# EAGLE design main (EAGLE 9.6.2)

## Sheet 1 of 4
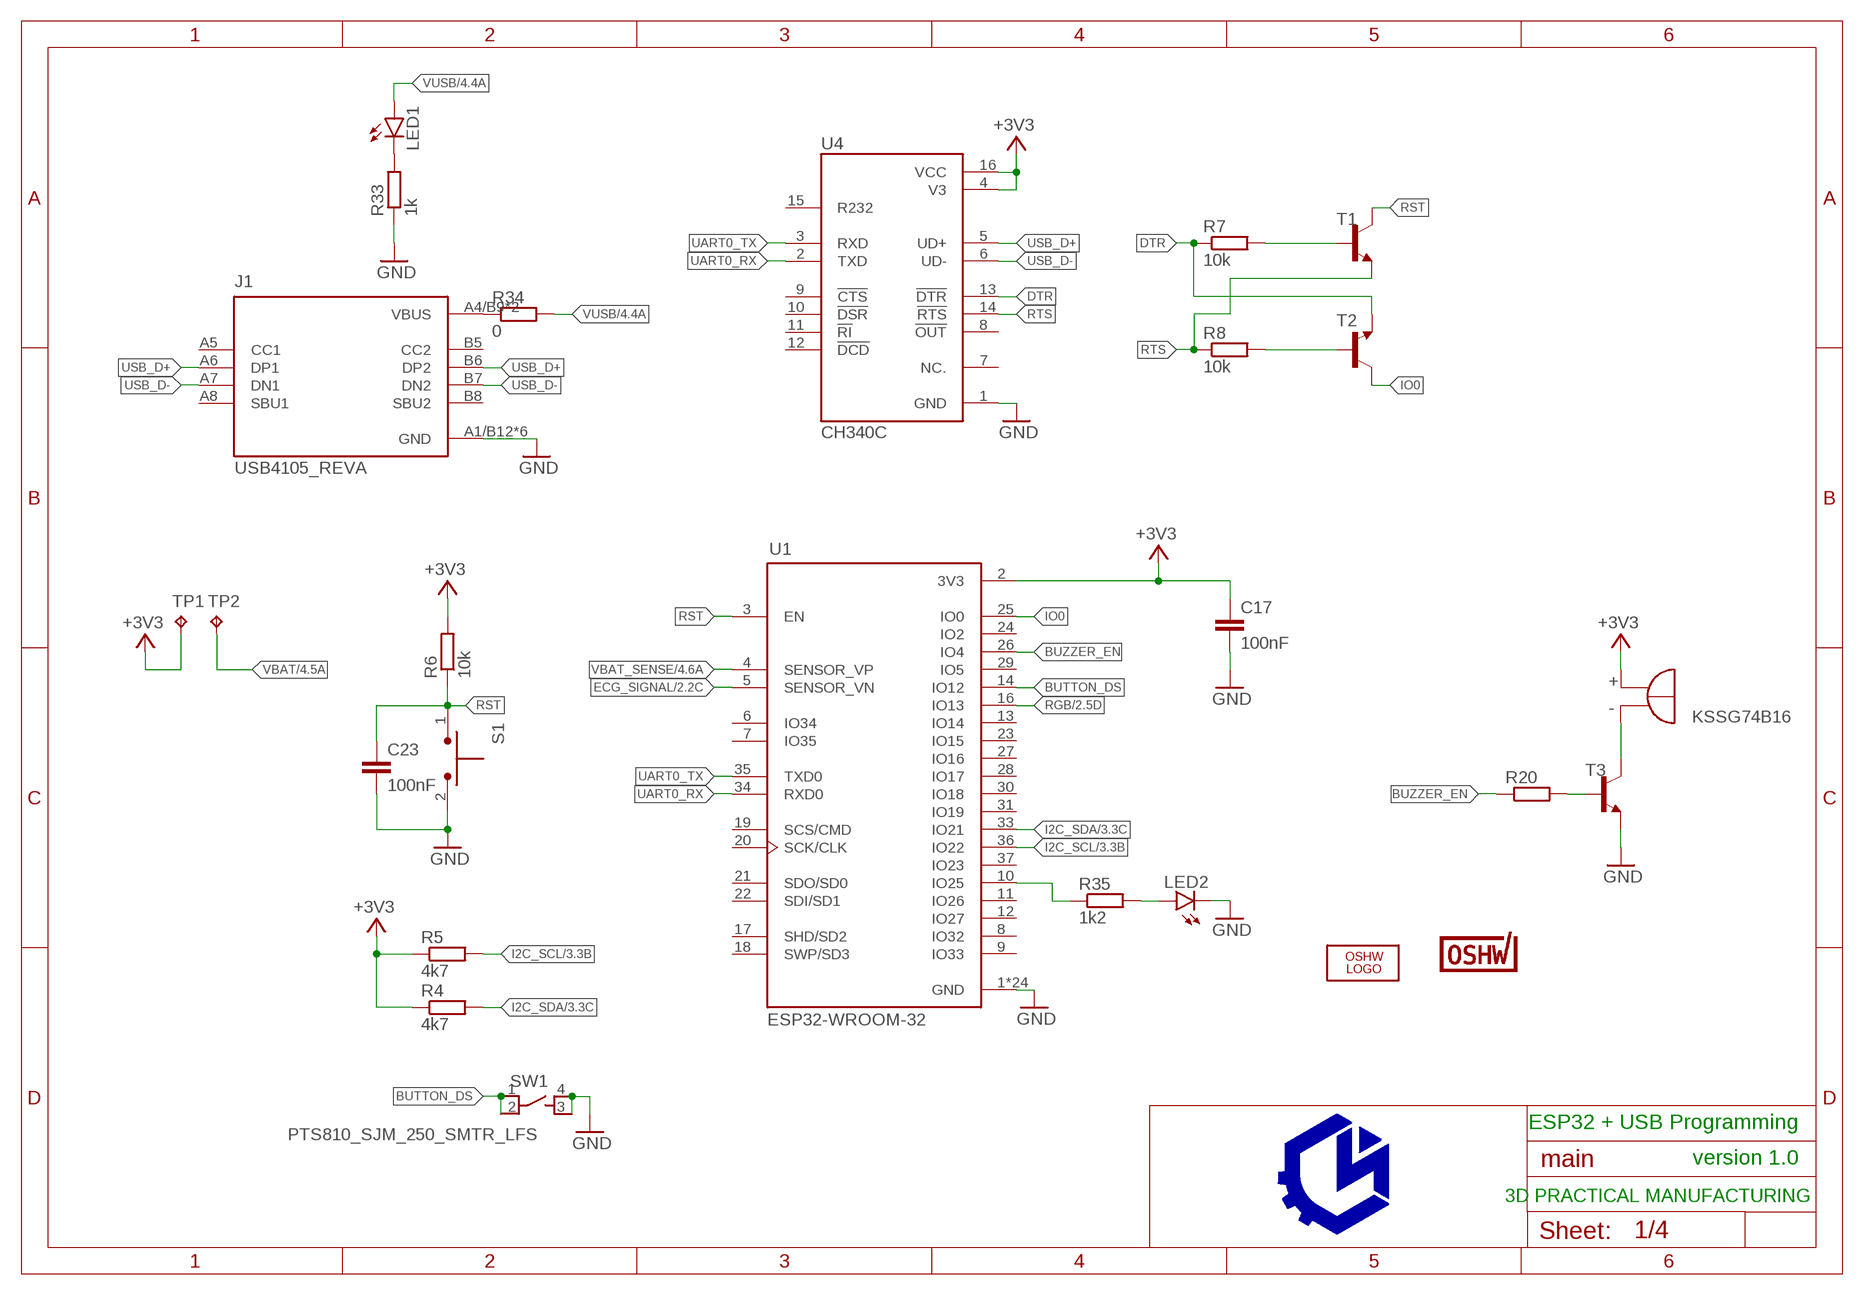
[diagram p0: schematic, sheet 1]

### Parts
C17  100nF  C-EUC0603  [C0603]
C23  100nF  C-EUC0603  [C0603]
J1  USB4105_REVA  [GCT_USB4105_REVA]
LED1  LEDCHIP-LED0805  [CHIP-LED0805]
LED2  LEDCHIP-LED0805  [CHIP-LED0805]
LOGO2  OSHW_LOGO_FILLX0200-NT  [OSHW_FILLX200_NOTEXT]
LS1  KSSG74B16  [XDCR_KSSG74B16]
R4  4k7  R-EU_R0603  [R0603]
R5  4k7  R-EU_R0603  [R0603]
R6  10k  R-EU_R0603  [R0603]
R7  10k  R-EU_R0603  [R0603]
R8  10k  R-EU_R0603  [R0603]
R20  R-EU_R0603  [R0603]
R33  1k  R-EU_R0603  [R0603]
R34  0  R-EU_R0603  [R0603]
R35  1k2  R-EU_R0603  [R0603]
S1  TL1015AF160QG  [SW_TL1015AF160QG]
SW1  PTS810_SJM_250_SMTR_LFS  [SW_PTS810_SJM_250_SMTR_LFS]
T1  MMBT4401LT1-NPN-SOT23-BEC  [SOT23-BEC]
T2  MMBT4401LT1-NPN-SOT23-BEC  [SOT23-BEC]
T3  MMBT4401LT1-NPN-SOT23-BEC  [SOT23-BEC]
TP1  TPB1,27  [B1,27]
TP2  TPB1,27  [B1,27]
U1  ESP32-WROOM-32  [MODULE_ESP32-WROOM-32]
U4  CH340C  [SOIC127P600X180-16N]
U$10  CERT-SMALL  [CERT-SMALL-SILK]

### Nets
+3V3: C17.1 LS1.P(POS) R4.1 R5.1 R6.2 TP1.TP U1.2(3V3) U4.4(V3) U4.16(VCC) ; also sheet 2,3,4
BUTTON_DS: SW1.1 SW1.2 U1.14(IO12)
BUZZER_EN: R20.1 U1.26(IO4)
DTR: R7.1 T2.E U4.13(!DTR)
ECG_SIGNAL: U1.5(SENSOR_VN) ; also sheet 2
GND: C17.2 C23.2 J1.A1/B12(GND) J1.B1/A12(GND) J1.G1(GND) J1.G2(GND) J1.G3(GND) J1.G4(GND) LED2.C R33.1 S1.2 SW1.3 SW1.4 T3.E U1.1(GND) U1.15(GND) U1.38(GND) U1.39_1(GND) U1.39_2(GND) U1.39_3(GND) U1.39_4(GND) U1.39_5(GND) U1.39_6(GND) U1.39_7(GND) U1.39_8(GND) U1.39_9(GND) U1.39_10(GND) U1.39_11(GND) U1.39_12(GND) U1.39_13(GND) U1.39_14(GND) U1.39_15(GND) U1.39_16(GND) U1.39_17(GND) U1.39_18(GND) U1.39_19(GND) U1.39_20(GND) U1.39_21(GND) U4.1(GND) ; also sheet 2,3,4
I2C_SCL: R5.2 U1.36(IO22) ; also sheet 3
I2C_SDA: R4.2 U1.33(IO21) ; also sheet 3
IO0: T2.C U1.25(IO0)
N$1: R7.2 T1.B
N$2: R8.2 T2.B
N$5: R20.2 T3.B
N$15: LED1.C R33.2
N$20: J1.A4/B9(VBUS) J1.B4/A9(VBUS) R34.1
N$22: LS1.N(NEG) T3.C
N$32: R35.1 U1.10(IO25)
N$33: LED2.A R35.2
RGB: U1.16(IO13) ; also sheet 2
RST: C23.1 R6.1 S1.1 T1.C U1.3(EN)
RTS: R8.1 T1.E U4.14(!RTS)
UART0_RX: U1.34(RXD0) U4.2(TXD)
UART0_TX: U1.35(TXD0) U4.3(RXD)
USB_D+: J1.A6(DP1) J1.B6(DP2) U4.5(UD+)
USB_D-: J1.A7(DN1) J1.B7(DN2) U4.6(UD-)
VBAT: TP2.TP ; also sheet 4
VBAT_SENSE: U1.4(SENSOR_VP) ; also sheet 4
VUSB: LED1.A R34.2 ; also sheet 4
Unconnected: J1.A5(CC1) J1.A8(SBU1) J1.B5(CC2) J1.B8(SBU2) U1.6(IO34) U1.7(IO35) U1.8(IO32) U1.9(IO33) U1.11(IO26) U1.12(IO27) U1.13(IO14) U1.17(SHD/SD2) U1.18(SWP/SD3) U1.19(SCS/CMD) U1.20(SCK/CLK) U1.21(SDO/SD0) U1.22(SDI/SD1) U1.23(IO15) U1.24(IO2) U1.27(IO16) U1.28(IO17) U1.29(IO5) U1.30(IO18) U1.31(IO19) U1.37(IO23) U4.7(NC.) U4.8(!OUT) U4.9(!CTS) U4.10(!DSR) U4.11(!RI) U4.12(!DCD) U4.15(R232)

### Notes on the sheet
- ESP32 + USB Programming
- version 1.0
- 3D PRACTICAL MANUFACTURING

## Sheet 2 of 4
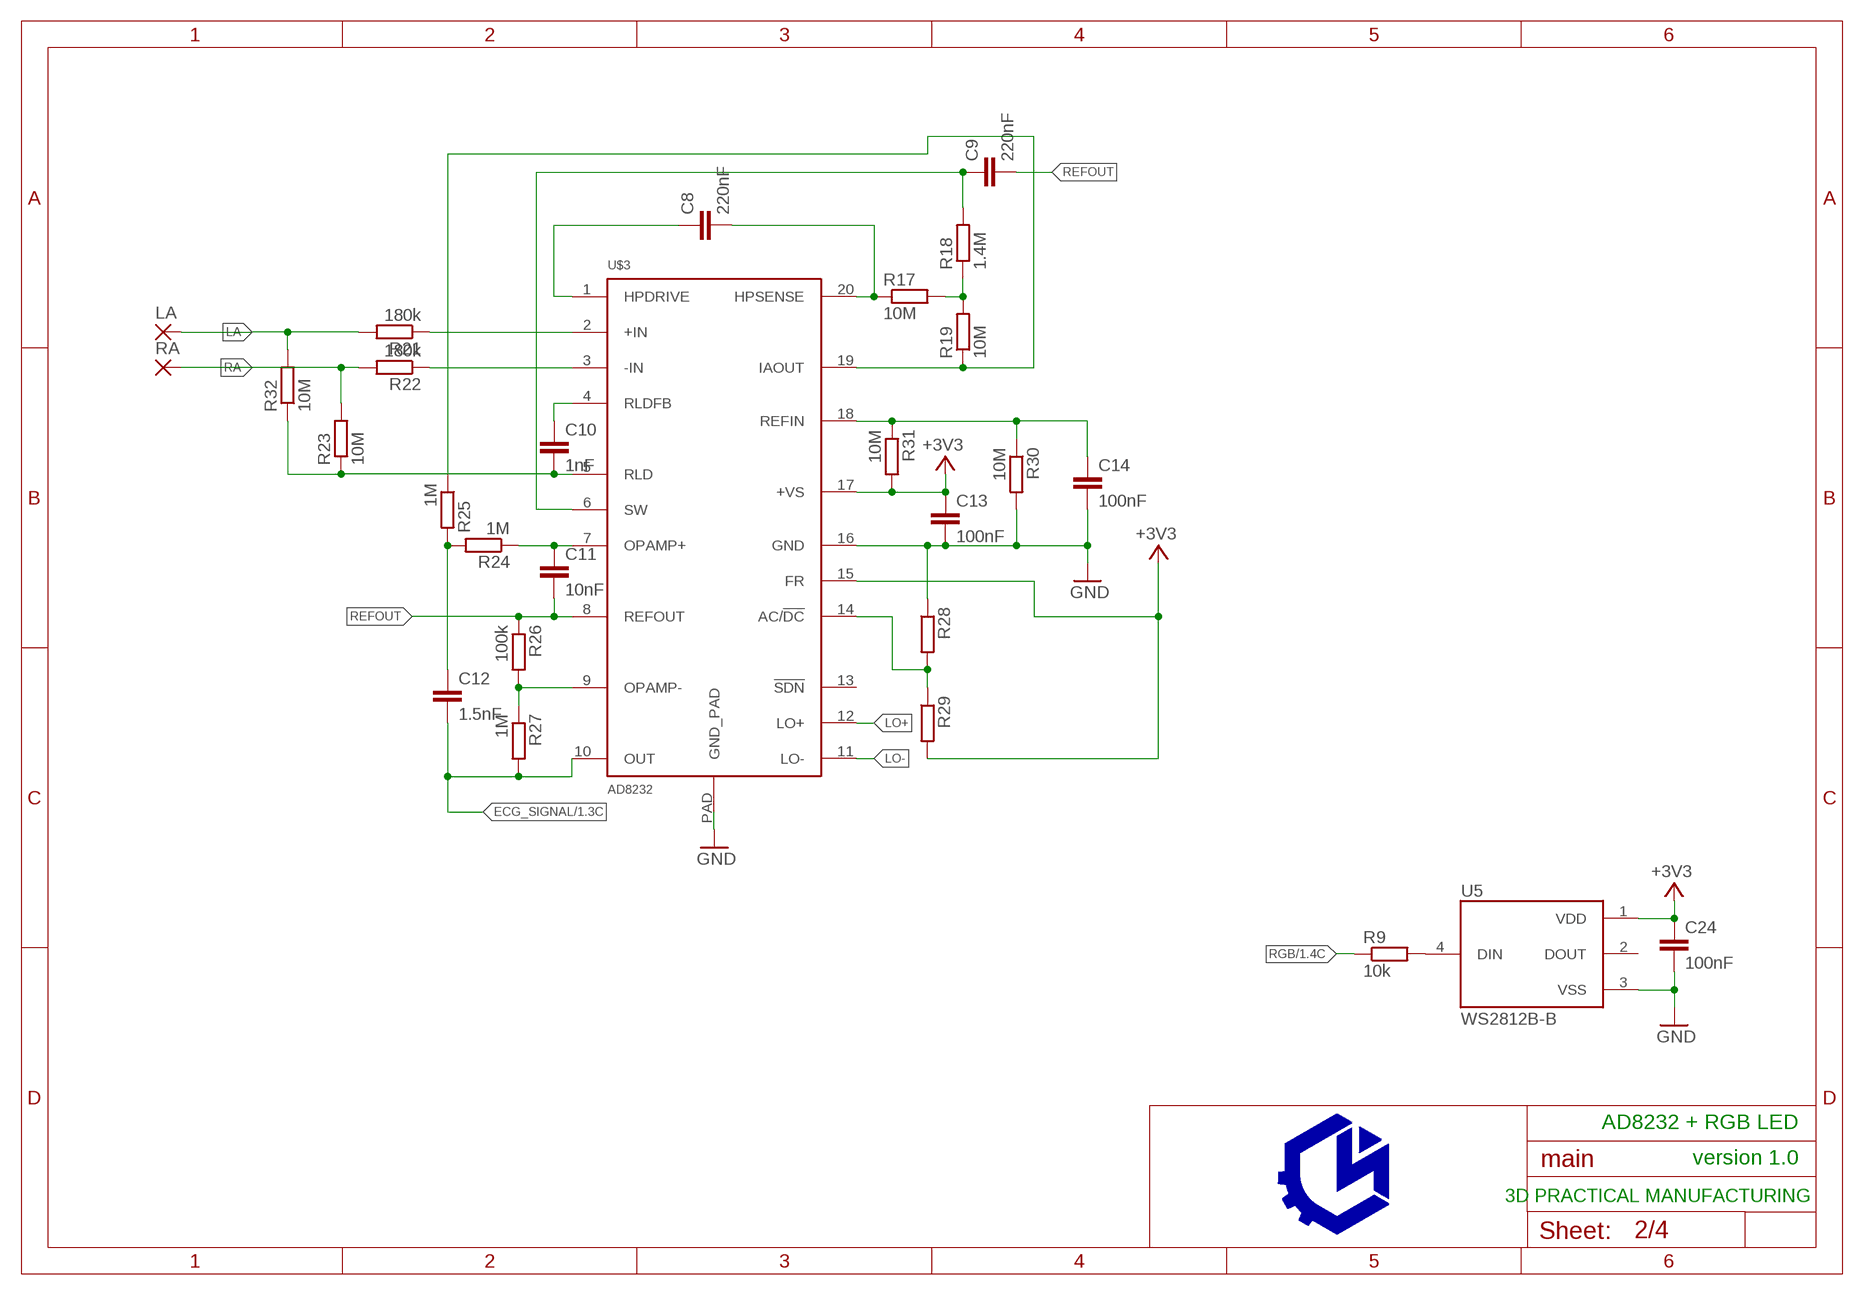
[diagram p1: schematic, sheet 2]

### Parts
C8  220nF  C-EUC0603  [C0603]
C9  220nF  C-EUC0603  [C0603]
C10  1nF  C-EUC0603  [C0603]
C11  10nF  C-EUC0603  [C0603]
C12  1.5nF  C-EUC0603  [C0603]
C13  100nF  C-EUC0603  [C0603]
C14  100nF  C-EUC0603  [C0603]
C24  100nF  C-EUC0603  [C0603]
LA  SMD2  [SMD1,27-2,54]
R9  10k  R-EU_R0603  [R0603]
R17  10M  R-EU_R0603  [R0603]
R18  1.4M  R-EU_R0603  [R0603]
R19  10M  R-EU_R0603  [R0603]
R21  180k  R-EU_R0603  [R0603]
R22  180k  R-EU_R0603  [R0603]
R23  10M  R-EU_R0603  [R0603]
R24  1M  R-EU_R0603  [R0603]
R25  1M  R-EU_R0603  [R0603]
R26  100k  R-EU_R0603  [R0603]
R27  1M  R-EU_R0603  [R0603]
R28  R-EU_R0603  [R0603]
R29  R-EU_R0603  [R0603]
R30  10M  R-EU_R0603  [R0603]
R31  10M  R-EU_R0603  [R0603]
R32  10M  R-EU_R0603  [R0603]
RA  SMD2  [SMD1,27-2,54]
U5  WS2812B-B  [LED_WS2812B-B]
U$3  AD8232  [LFCSP_20]

### Nets
+3V3: C13.1 C24.1 R29.2 R31.2 U5.1(VDD) U$3.15(FR) U$3.17(+VS) ; also sheet 1,3,4
ECG_SIGNAL: C12.2 R27.2 U$3.10(OUT) ; also sheet 1
GND: C13.2 C14.2 C24.2 R28.1 R30.2 U5.3(VSS) U$3.16(GND) U$3.PAD(GND_PAD) ; also sheet 1,3,4
LA: LA.1(P) R21.2 R32.2
LO+: U$3.12(LO+)
LO-: U$3.11(LO-)
N$3: R9.2 U5.4(DIN)
N$10: C8.2 R17.1 U$3.20(HPSENSE)
N$11: C8.1 U$3.1(HPDRIVE)
N$12: R19.1 R25.1 U$3.19(IAOUT)
N$13: R17.2 R18.1 R19.2
N$14: C9.1 R18.2 U$3.6(SW)
N$16: C12.1 R24.2 R25.2
N$18: R21.1 U$3.2(+IN)
N$19: R22.1 U$3.3(-IN)
N$30: C10.1 U$3.4(RLDFB)
N$31: C10.2 R23.1 R32.1 U$3.5(RLD)
N$34: C11.1 R24.1 U$3.7(OPAMP+)
N$36: R26.2 R27.1 U$3.9(OPAMP-)
N$38: R28.2 R29.1 U$3.14(AC/!DC)
N$39: C14.1 R30.1 R31.1 U$3.18(REFIN)
RA: R22.2 R23.2 RA.1(P)
REFOUT: C9.2 C11.2 R26.1 U$3.8(REFOUT)
RGB: R9.1 ; also sheet 1
Unconnected: U5.2(DOUT) U$3.13(!SDN)

### Notes on the sheet
- AD8232 + RGB LED
- version 1.0
- 3D PRACTICAL MANUFACTURING

## Sheet 3 of 4
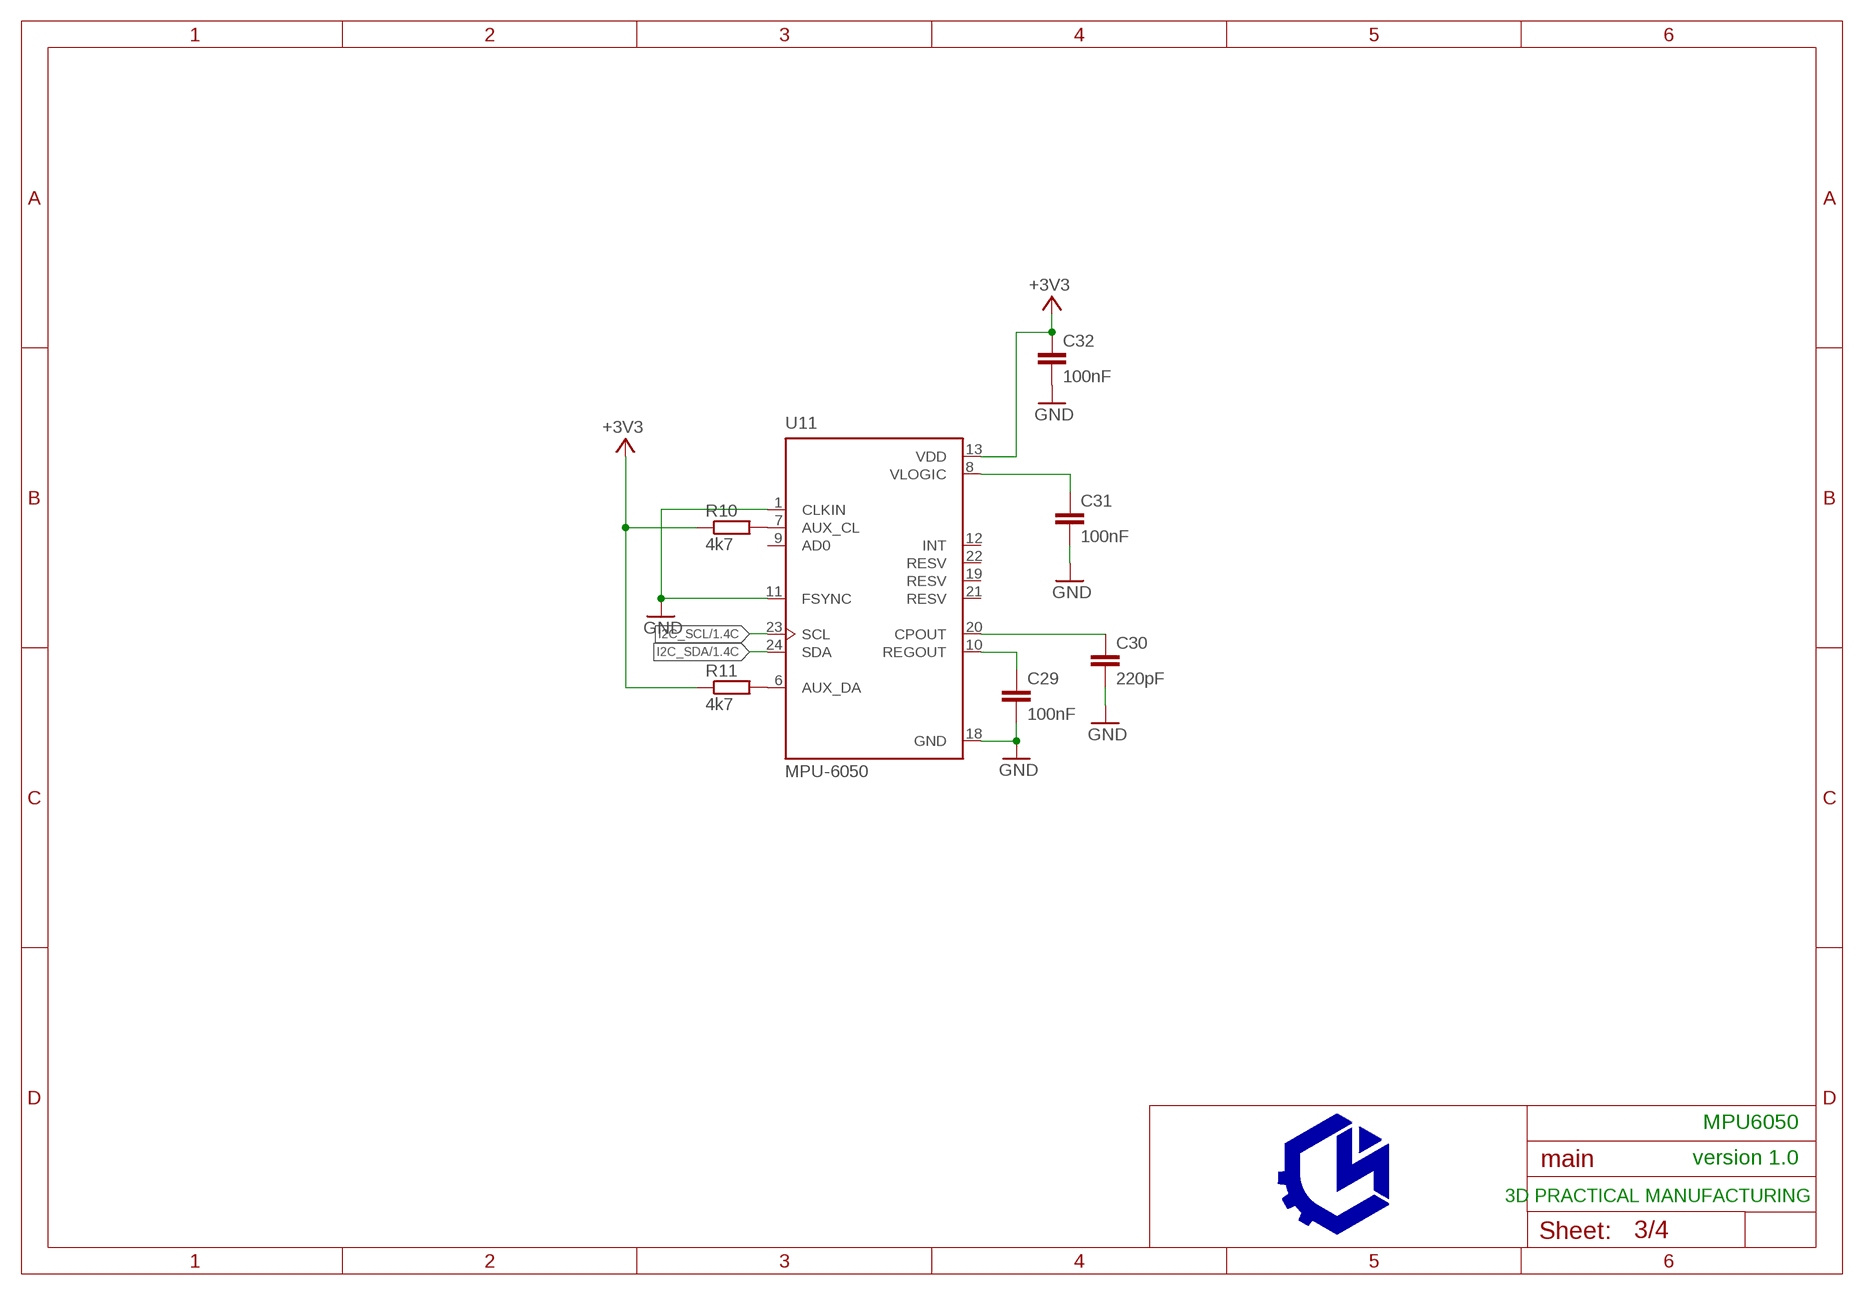
[diagram p2: schematic, sheet 3]

### Parts
C29  100nF  C-EUC0603  [C0603]
C30  220pF  C-EUC0603  [C0603]
C31  100nF  C-EUC0603  [C0603]
C32  100nF  C-EUC0603  [C0603]
R10  4k7  R-EU_R0603  [R0603]
R11  4k7  R-EU_R0603  [R0603]
U11  MPU-6050  [QFN50P400X400X95-24N]

### Nets
+3V3: C32.1 R10.1 R11.1 U11.13(VDD) ; also sheet 1,2,4
GND: C29.2 C30.2 C31.2 C32.2 U11.1(CLKIN) U11.11(FSYNC) U11.18(GND) ; also sheet 1,2,4
I2C_SCL: U11.23(SCL) ; also sheet 1
I2C_SDA: U11.24(SDA) ; also sheet 1
N$8: C29.1 U11.10(REGOUT)
N$24: R10.2 U11.7(AUX_CL)
N$25: R11.2 U11.6(AUX_DA)
N$26: C31.1 U11.8(VLOGIC)
N$27: C30.1 U11.20(CPOUT)
Unconnected: U11.9(AD0) U11.12(INT) U11.19(RESV) U11.21(RESV) U11.22(RESV)

### Notes on the sheet
- MPU6050
- version 1.0
- 3D PRACTICAL MANUFACTURING

## Sheet 4 of 4
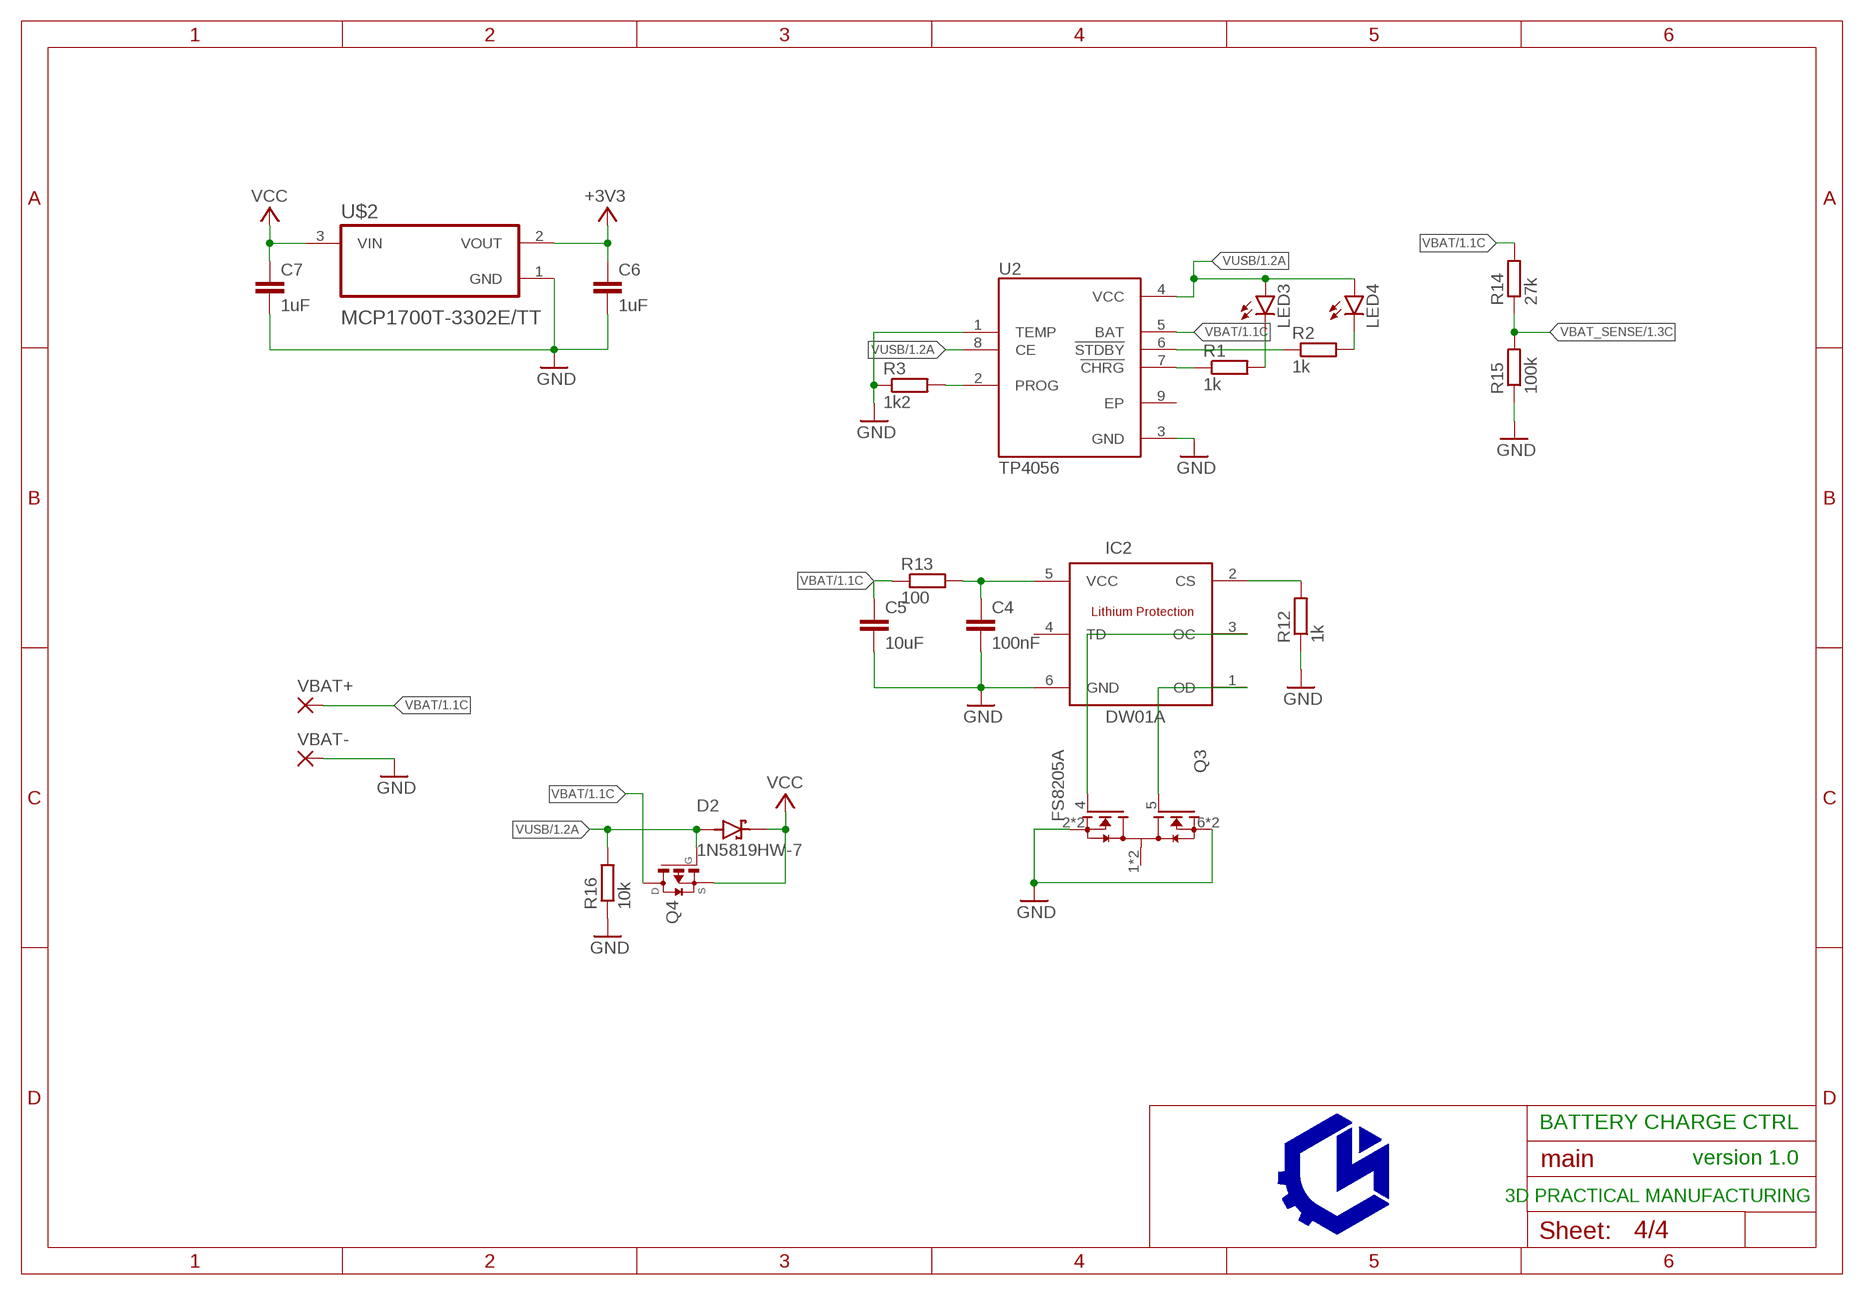
[diagram p3: schematic, sheet 4]

### Parts
C4  100nF  C-EUC0603  [C0603]
C5  10uF  C-EUC0603  [C0603]
C6  1uF  C-EUC0603  [C0603]
C7  1uF  C-EUC0603  [C0603]
D2  1N5819HW-7  [SOD3715X145N]
IC2  DW01A  [SOT23-6]
LED3  LEDCHIP-LED0603  [CHIP-LED0603]
LED4  LEDCHIP-LED0603  [CHIP-LED0603]
Q3  FS8205A  [SOP65P640X120-8N]
Q4  TRANSISTOR-FET_DMP2004K  [TRANSISTOR-FET_SOT23]
R1  1k  R-EU_R0603  [R0603]
R2  1k  R-EU_R0603  [R0603]
R3  1k2  R-EU_R0603  [R0603]
R12  1k  R-EU_R0603  [R0603]
R13  100  R-EU_R0603  [R0603]
R14  27k  R-EU_R0603  [R0603]
R15  100k  R-EU_R0603  [R0603]
R16  10k  R-EU_R0603  [R0603]
U2  TP4056  [SOP127P600X175-9N]
U$2  MCP1700T-3302E/TT  [SOT95P237X112-3N]
VBAT+  WIREPADSMD1,27-254  [SMD1,27-2,54]
VBAT-  WIREPADSMD1,27-254  [SMD1,27-2,54]

### Nets
+3V3: C6.1 U$2.2(VOUT) ; also sheet 1,2,3
GND: C4.2 C5.2 C6.2 C7.2 IC2.6(GND) Q3.2(S1) Q3.3(S1) Q3.6(S2) Q3.7(S2) R3.1 R12.1 R15.1 R16.1 U2.1(TEMP) U2.3(GND) U$2.1(GND) VBAT-.1(P) ; also sheet 1,2,3
N$4: R2.1 U2.6(!STDBY)
N$6: LED3.C R1.2
N$7: LED4.C R2.2
N$9: R1.1 U2.7(!CHRG)
N$17: R3.2 U2.2(PROG)
N$21: IC2.1(OD) Q3.5(G2)
N$23: IC2.3(OC) Q3.4(G1)
N$28: IC2.2(CS) R12.2
N$29: C4.1 IC2.5(VCC) R13.2
VBAT: C5.1 Q4.3(D) R13.1 R14.2 U2.5(BAT) VBAT+.1(P) ; also sheet 1
VBAT_SENSE: R14.1 R15.2 ; also sheet 1
VCC: C7.1 D2.C(K) Q4.2(S) U$2.3(VIN)
VUSB: D2.A LED3.A LED4.A Q4.1(G) R16.2 U2.4(VCC) U2.8(CE) ; also sheet 1
Unconnected: IC2.4(TD) Q3.1(D12) Q3.8(D12) U2.9(EP)

### Notes on the sheet
- BATTERY CHARGE CTRL
- version 1.0
- 3D PRACTICAL MANUFACTURING

## Library data of the parts
C4-C14 C17 C23 C24 C29-C32 = rcl:C-EU: CAPACITOR, European symbol; SPICEPREFIX: C
D2 = 1N5819HW-7:1N5819HW-7: 1N5819HW Series 40 V 1 A Surface Mount Schottky Barrier Rectifier - SOD-123 Check availability <https://pricing.snapeda.com/parts/1N5819HW-7/Diodes%20Inc./view-part?ref=eda>; AVAILABILITY: In Stock; DESCRIPTION: Diode Schottky 40 V 1A Surface Mount SOD-123; MF: Diodes Inc.; MP: 1N5819HW-7; PACKAGE: SOD-123 Fairchild Semiconductor; PRICE: None; PURCHASE-URL: https://pricing.snapeda.com/search/part/1N5819HW-7/?ref=eda
IC2 = DW01A:DW01A: Check availability <https://pricing.snapeda.com/parts/DW01A/Fortune%20Semiconductor/view-part?ref=eda>; AVAILABILITY: Not in stock; DESCRIPTION: One Cell Lithium-ion/Polymer Battery Protection IC; MF: Fortune Semiconductor; MP: DW01A; PACKAGE: SOT-23-6 Fortune Semiconductor; PRICE: None
J1 = USB4105_REVA:USB4105_REVA: USB Type C Receptacle for USB 2.0 SMT Type, PCB Top Mount; AVAILABILITY: Unavailable; DESCRIPTION: USB-C (USB TYPE-C) USB 2.0 Receptacle Connector 24 (16+8 Dummy) Position Surface Mount, Right Angle; Through Hole; MF: Global Connector Technology; MP: USB4105; PACKAGE: Package; PRICE: None
LA RA = wirepad:SMD2: SMD PAD
LED1-LED4 = led:LED: LED OSRAM: - CHIPLED LG R971, LG N971, LY N971, LG Q971, LY Q971, LO R971, LY R971 LH N974, LH R974 LS Q976, LO Q976, LY Q976 LO Q996 - Hyper CHIPLED LW Q18S LB Q993, LB Q99A, LB R99A - SideLED LS A670, LO A670, LY A670, LG A670, LP A670 LB A673, LV A673, LT A673, LW A673 LH A674 LY A675 LS A676, LA A676, LO A676, LY A676, LW A676 LS A679, LY A679, LG A679 - Hyper Micro SIDELED® LS Y876, LA Y876, LO Y876, LY Y876 LT Y87S - SmartLED LW L88C, LW L88S LB L89C, LB L89S, LG L890 LS L89K, LO L89K, LY L89K LS L896, LA L896, LO L896, LY L896 - TOPLED LS T670, LO T670, LY T670, LG T670, LP T670 LSG T670, LSP T670, LSY T670, LOP T670, LYG T670 LG T671, LOG T671, LSG T671 LB T673, LV T673, LT T673, LW T673 LH T674 LS T676, LA T676, LO T676, LY T676, LB T676, LH T676, LSB T676, LW T676 LB T67C, LV T67C, LT T67C, LS T67K, LO T67K, LY T67K, LW E67C LS E67B, LA E67B, LO E67B, LY E67B, LB E67C, LV E67C, LT E67C LW T67C LS T679, LY T679, LG T679 LS T770, LO T770, LY T770, LG T770, LP T770 LB T773, LV T773, LT T773, LW T773 LH T774 LS E675, LA E675, LY E675, LS T675 LS T776, LA T776, LO T776, LY T776, LB T776 LHGB T686 LT T68C, LB T68C - Hyper Mini TOPLED® LB M676 - Mini TOPLED Santana® LG M470 LS M47K, LO M47K, LY M47K Source: http://www.osram.convergy.de LUXEON: - LUMILED® LXK2-PW12-R00, LXK2-PW12-S00, LXK2-PW14-U00, LXK2-PW14-V00 LXK2-PM12-R00, LXK2-PM12-S00, LXK2-PM14-U00 LXK2-PE12-Q00, LXK2-PE12-R00, LXK2-PE12-S00, LXK2-PE14-T00, LXK2-PE14-U00 LXK2-PB12-K00, LXK2-PB12-L00, LXK2-PB12-M00, LXK2-PB14-N00, LXK2-PB14-P00, LXK2-PB14-Q00 LXK2-PR12-L00, LXK2-PR12-M00, LXK2-PR14-Q00, LXK2-PR14-R00 LXK2-PD12-Q00, LXK2-PD12-R00, LXK2-PD12-S00 LXK2-PH12-R00, LXK2-PH12-S00 LXK2-PL12-P00, LXK2-PL12-Q00, LXK2-PL12-R00 Source: www.luxeon.com KINGBRIGHT: KA-3528ASYC Source: www.kingbright.com
LOGO2 = ohw-logo:OSHW_LOGO_FILL
LS1 = KSSG74B16:KSSG74B16: Check availability <https://pricing.snapeda.com/parts/KSSG74B16/Kingstate/view-part?ref=eda>; AVAILABILITY: In Stock; DESCRIPTION: 8.5mm, 3.6V, 2.73KHz, 87dB, High SPL Magnetic Buzzer, SMT; MF: Kingstate; MP: KSSG74B16; PACKAGE: DIP-16 kingstate; PRICE: None
Q3 = FS8205A:FS8205A: N/A Check availability <https://pricing.snapeda.com/parts/FS8205A/Fortune%20Semiconductor/view-part?ref=eda>; AVAILABILITY: Not in stock; MF: Fortune Semiconductor; MP: FS8205A; PACKAGE: Package; PRICE: None
Q4 = 52101-101-REV-A_v16:TRANSISTOR-FET_DMP2004K: P-Channel Enhancement MOSFET
R1-R35 = rcl:R-EU_: RESISTOR, European symbol; SPICEPREFIX: R
S1 = TL1015AF160QG:TL1015AF160QG: Tactile Switch SPST-NO Top Actuated Surface Mount Check prices <https://pricing.snapeda.com/parts/TL1015AF160QG/E-Switch/view-part?ref=eda>; AVAILABILITY: In Stock; DESCRIPTION: Tactile Switch SPST-NO Top Actuated Surface Mount; MF: E-Switch; MP: TL1015AF160QG; PACKAGE: SOIC-14 E-Switch; PRICE: None; PURCHASE-URL: https://pricing.snapeda.com/search/part/TL1015AF160QG/?ref=eda
SW1 = PTS810_SJM_250_SMTR_LFS:PTS810_SJM_250_SMTR_LFS: Switch Tactile Spst-No 0.05a 16v Check prices <https://pricing.snapeda.com/parts/PTS810%20SJM%20250%20SMTR%20LFS/C%26K/view-part?ref=eda>; AVAILABILITY: In Stock; DESCRIPTION: Tactile Switch SPST-NO Top Actuated Surface Mount; MF: C&K; MP: PTS810 SJM 250 SMTR LFS; PACKAGE: None; PRICE: None; PURCHASE-URL: https://pricing.snapeda.com/search/part/PTS810 SJM 250 SMTR LFS/?ref=eda
T1-T3 = DC_LOAD_AU:*-NPN-: NPN Transistror BF959 corrected 2008.03.06
TP1 TP2 = testpad:TP: Test pad
U1 = ESP32-WROOM-32:ESP32-WROOM-32: Bluetooth, WiFi Transceiver Module 2.4GHz ~ 2.5GHz Surface Mount; AVAILABILITY: Unavailable; DESCRIPTION: Bluetooth, WiFi 802.11b/g/n, Bluetooth v4.2 +EDR, Class 1, 2 and 3 Transceiver Module 2.4GHz ~ 2.5GHz Antenna Not Included, U.FL Surface Mount; MF: Espressif Systems; MP: ESP32-WROOM-32; PACKAGE: Module Espressif Systems; PRICE: None
U2 = TP4056:TP4056: Complete single cell Li-Ion battery with a constant current / constant voltage linear charger Check availability <https://pricing.snapeda.com/parts/TP4056/NanJing%20Top%20Power%20ASIC%20Corp./view-part?ref=eda>; AVAILABILITY: Not in stock; DESCRIPTION: Complete single cell Li-Ion battery with a constant current / constant voltage linear charger; MF: NanJing Top Power ASIC Corp.; MP: TP4056; PACKAGE: None; PRICE: None
U4 = CH340C:CH340C: USB to serial chip CH340 Check availability <https://pricing.snapeda.com/parts/CH340C/WCH/view-part?ref=eda>; AVAILABILITY: Not in stock; DESCRIPTION: USB to serial chip CH340; MF: WCH; MP: CH340C; PACKAGE: None; PRICE: None
U5 = WS2812B-B:WS2812B-B: Intelligent control LED integrated light source Check availability <https://pricing.snapeda.com/parts/WS2812B-B/Worldsemi/view-part?ref=eda>; AVAILABILITY: Not in stock; DESCRIPTION: Intelligent control LED integrated light source; MF: Worldsemi; MP: WS2812B-B; PACKAGE: Package; PRICE: None
U11 = MPU-6050:MPU-6050: MPU-6050 Six-Axis (Gyro + Accelerometer) MEMS MotionTracking™ Devices Check availability <https://pricing.snapeda.com/parts/MPU-6050/TDK%20InvenSense/view-part?ref=eda>; AVAILABILITY: In Stock; DESCRIPTION: MPU-6050 series Accelerometer, Gyroscope, 3 Axis Sensor Evaluation Board; MF: TDK InvenSense; MP: MPU-6050; PACKAGE: QFN-24 InvenSense; PRICE: None; PURCHASE-URL: https://pricing.snapeda.com/search/part/MPU-6050/?ref=eda
U$2 = MCP1700T-3302E_TT:MCP1700T-3302E/TT: Check availability <https://pricing.snapeda.com/parts/MCP1700T-3302E/TT/Microchip/view-part?ref=eda>; AVAILABILITY: In Stock; DESCRIPTION: Linear Voltage Regulator IC Positive Fixed 1 Output 250mA SOT-23-3; MF: Microchip; MP: MCP1700T-3302E/TT; PACKAGE: SOT-23 Microchip; PRICE: None; PURCHASE-URL: https://pricing.snapeda.com/search/part/MCP1700T-3302E/TT/?ref=eda
U$3 = AD8232:AD8232: Check availability <https://pricing.snapeda.com/parts/AD8232/Analog%20Devices%2C%20Inc./view-part?ref=eda>; AVAILABILITY: In Stock; DESCRIPTION: AD8232 Analog Front End Evaluation Board; MF: Analog Devices, Inc.; MP: AD8232; PACKAGE: None; PRICE: None; PURCHASE-URL: https://pricing.snapeda.com/search/part/AD8232/?ref=eda
U$10 = OSHWA:CERT
VBAT+ VBAT- = wirepad:WIREPAD: Wire PAD connect wire on PCB

## Board
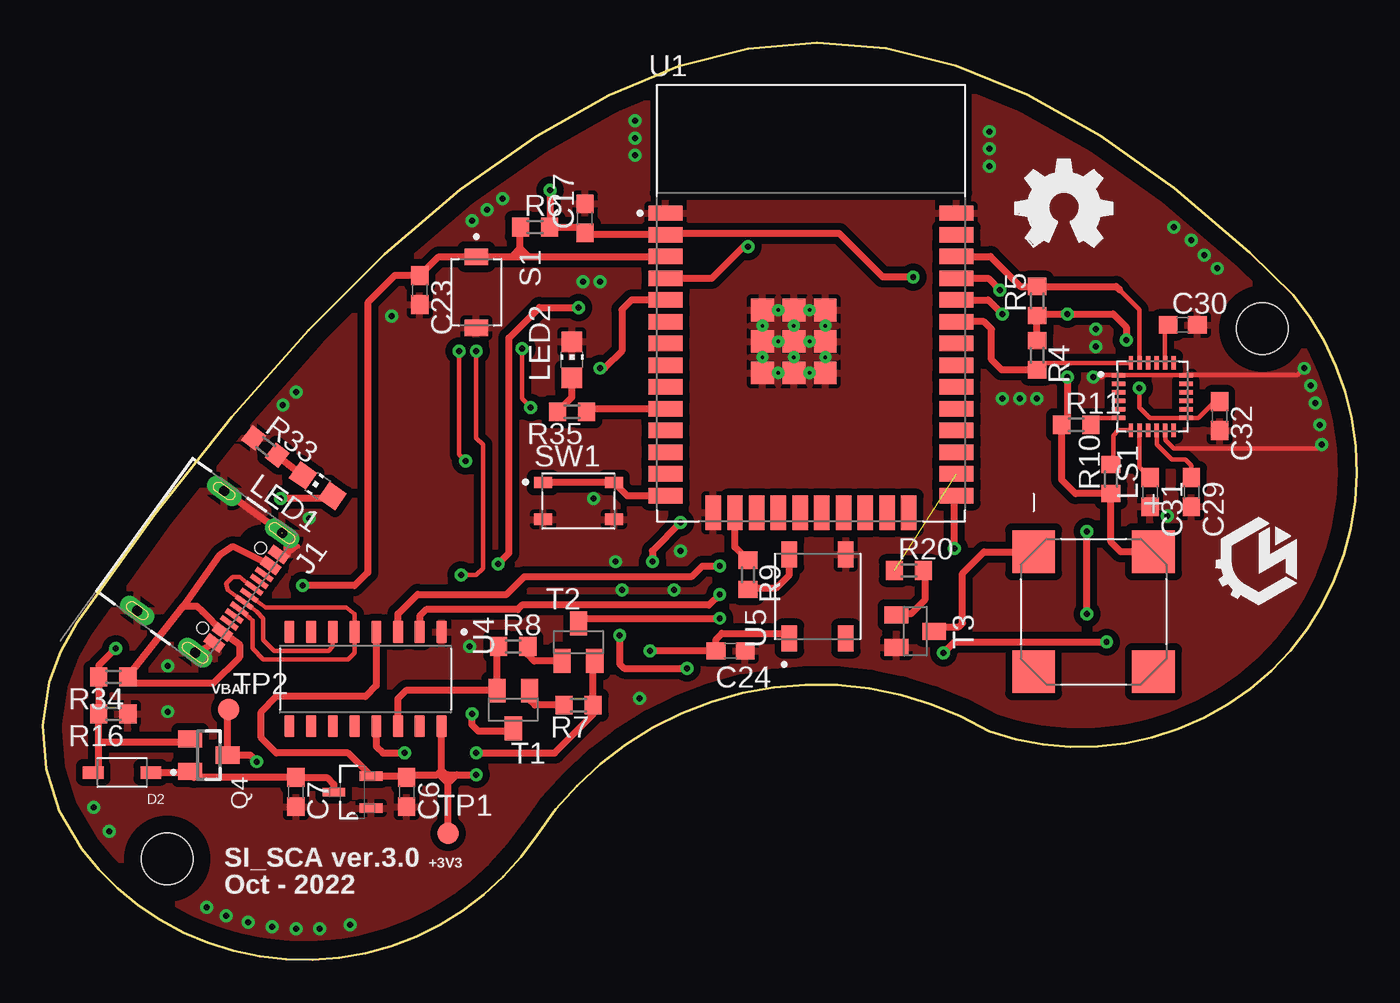
[diagram p4: board, top side]
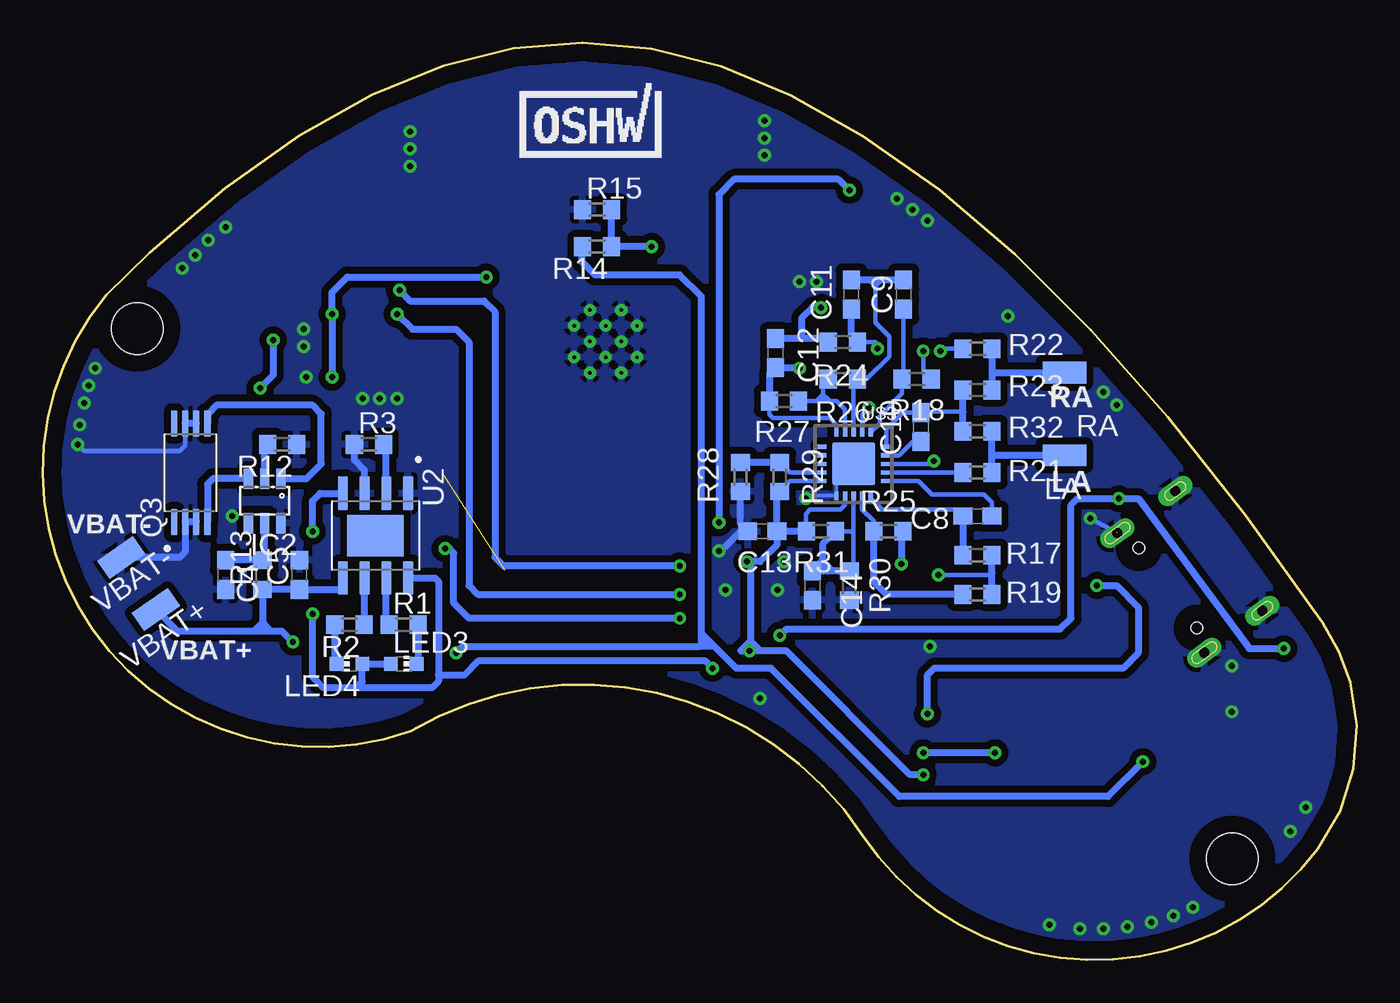
[diagram p5: board, bottom side, seen from below]

Size 76.78 x 53.6 mm. Coordinates in mm from the lower left corner, seen from the top.
Outline: 0.39,16.25 0,13.71 0.2,11.15 0.96,8.7 2.27,6.48 arc109 28.87,7.28 arc-87 55.3,13.35 arc149 73.08,38.85 70.52,41.32 66.12,45.09 61.79,48.18 57.54,50.57 53.37,52.26 49.28,53.27 45.25,53.6 41.21,53.26 37.14,52.24 33.1,50.54 28.84,48.13 24.38,45.02 19.99,41.24 15.53,36.8 11.04,31.71 6.52,26 1.98,19.68 1.04,18.03 0.39,16.25
Copper layers (1*16): Top 0.035mm / dielectric 1.5mm / Bottom 0.035mm
Design rules "default *": minimum track width 6mil, minimum drill 0.35mm, track to track 6mil, track to pad 6mil, pad to pad 6mil, via to via 6mil, smd to smd 6mil, copper to edge 40mil, drill to drill 6mil, minimum pad ring 10mil, minimum via ring 8mil, stop-mask expansion 4mil, vias tented up to drill 24mil, thermal gap 10mil
Holes 3 mm at 7.27,5.9 71.27,36.9

### Footprints (pad centres in the part's own frame; a part is rotated, then mirrored left to right if it is on the bottom)
C0603 = smd 1.1 x 1: 1 -0.85,0; 2 0.85,0
SOD3715X145N = smd 1.21 x 0.73: A 1.68,0; C -1.68,0
SOT23-6 = smd 0.55 x 1.2: 1 -0.95,-1.3; 2 0,-1.3; 3 0.95,-1.3; 4 0.95,1.3; 5 0,1.3; 6 -0.95,1.3
GCT_USB4105_REVA = smd 0.6 x 1.15: A1/B12 -3.2,4.755; A4/B9 -2.4,4.755; B1/A12 3.2,4.755; B4/A9 2.4,4.755 | smd 0.3 x 1.15: A5 -1.25,4.755; A6 -0.25,4.755; A7 0.25,4.755; A8 1.25,4.755; B5 1.75,4.755; B6 0.75,4.755; B7 -0.75,4.755; B8 -1.75,4.755 | drill 0.6 pad 1 long: G1 -4.32,0; G2 4.32,0 | drill 0.6 pad 1.05 long: G3 -4.32,4.18; G4 4.32,4.18 | hole 0.65: 2.89,3.68; -2.89,3.68
SMD1,27-2,54 = smd 1.27 x 2.54: 1 0,0
CHIP-LED0805 = smd 1.2 x 1.2: A 0,-1.05; C 0,1.05
CHIP-LED0603 = smd 0.8 x 0.8: A 0,-0.75; C 0,0.75
XDCR_KSSG74B16 = smd 2.5 x 2.5: N -3.5,-3.5; NC1 3.5,3.5; NC2 3.5,-3.5; P -3.5,3.5
SOP65P640X120-8N = smd 1.56 x 0.4: 1 -2.88,0.975; 2 -2.88,0.325; 3 -2.88,-0.325; 4 -2.88,-0.975; 5 2.88,-0.975; 6 2.88,-0.325; 7 2.88,0.325; 8 2.88,0.975
TRANSISTOR-FET_SOT23 = smd 1 x 1.4: 1 -0.95,-1.1; 2 0.95,-1.1; 3 0,1.1
R0603 = smd 1 x 1.1: 1 -0.85,0; 2 0.85,0
SW_TL1015AF160QG = smd 0.95 x 1.4: 1 -2.075,0; 2 2.075,0
SW_PTS810_SJM_250_SMTR_LFS = smd 1.05 x 0.65: 1 -2.075,1.075; 2 2.075,1.075; 3 -2.075,-1.075; 4 2.075,-1.075
SOT23-BEC = smd 1 x 1.4: B -0.95,-1.1; C 0,1.1; E 0.95,-1.1
B1,27 = smd 1.27 x 1.27: TP 0,0
MODULE_ESP32-WROOM-32 = smd 2 x 0.9: 1 -8.5,5.26; 2 -8.5,3.99; 3 -8.5,2.72; 4 -8.5,1.45; 5 -8.5,0.18; 6 -8.5,-1.09; 7 -8.5,-2.36; 8 -8.5,-3.63; 9 -8.5,-4.9; 10 -8.5,-6.17; 11 -8.5,-7.44; 12 -8.5,-8.71; 13 -8.5,-9.98; 14 -8.5,-11.25; 25 8.5,-11.25; 26 8.5,-9.98; 27 8.5,-8.71; 28 8.5,-7.44; 29 8.5,-6.17; 30 8.5,-4.9; 31 8.5,-3.63; 32 8.5,-2.36; 33 8.5,-1.09; 34 8.5,0.18; 35 8.5,1.45; 36 8.5,2.72; 37 8.5,3.99; 38 8.5,5.26 | smd 0.9 x 2: 15 -5.715,-12.25; 16 -4.445,-12.25; 17 -3.175,-12.25; 18 -1.905,-12.25; 19 -0.635,-12.25; 20 0.635,-12.25; 21 1.905,-12.25; 22 3.175,-12.25; 23 4.445,-12.25; 24 5.715,-12.25 | smd 1.33 x 1.33: 39_1 -2.835,-0.405; 39_2 -1,-0.405; 39_3 0.835,-0.405; 39_4 -2.835,-2.24; 39_5 -1,-2.24; 39_6 0.835,-2.24; 39_7 -2.835,-4.075; 39_8 -1,-4.075; 39_9 0.835,-4.075 | drill 0.2 pad 0.3: 39_10 -1.917,-0.405; 39_11 -0.083,-0.405; 39_12 -2.835,-1.323; 39_13 -1,-1.323; 39_14 0.835,-1.323; 39_15 -1.917,-2.24; 39_16 -0.083,-2.24; 39_17 -2.835,-3.158; 39_18 -1,-3.158; 39_19 0.835,-3.158; 39_20 -1.917,-4.075; 39_21 -0.083,-4.075
SOP127P600X175-9N = smd 1.97 x 0.6: 1 -2.475,1.905; 2 -2.475,0.635; 3 -2.475,-0.635; 4 -2.475,-1.905; 5 2.475,-1.905; 6 2.475,-0.635; 7 2.475,0.635; 8 2.475,1.905 | smd 2.413 x 3.302: 9 0,0
SOIC127P600X180-16N = smd 1.31 x 0.62: 1 -2.75,4.445; 2 -2.75,3.175; 3 -2.75,1.905; 4 -2.75,0.635; 5 -2.75,-0.635; 6 -2.75,-1.905; 7 -2.75,-3.175; 8 -2.75,-4.445; 9 2.75,-4.445; 10 2.75,-3.175; 11 2.75,-1.905; 12 2.75,-0.635; 13 2.75,0.635; 14 2.75,1.905; 15 2.75,3.175; 16 2.75,4.445
LED_WS2812B-B = smd 1.5 x 0.9: 1 -2.45,1.65; 2 -2.45,-1.65; 3 2.45,-1.65; 4 2.45,1.65
QFN50P400X400X95-24N = smd 0.79 x 0.26: 1 -1.97,1.25; 2 -1.97,0.75; 3 -1.97,0.25; 4 -1.97,-0.25; 5 -1.97,-0.75; 6 -1.97,-1.25; 13 1.97,-1.25; 14 1.97,-0.75; 15 1.97,-0.25; 16 1.97,0.25; 17 1.97,0.75; 18 1.97,1.25 | smd 0.26 x 0.79: 7 -1.25,-1.97; 8 -0.75,-1.97; 9 -0.25,-1.97; 10 0.25,-1.97; 11 0.75,-1.97; 12 1.25,-1.97; 19 1.25,1.97; 20 0.75,1.97; 21 0.25,1.97; 22 -0.25,1.97; 23 -0.75,1.97; 24 -1.25,1.97
SOT95P237X112-3N = smd 1.321 x 0.559: 1 -1.092,0.94; 2 -1.092,-0.94 | smd 1.321 x 0.508: 3 1.092,0
LFCSP_20 = smd 0.5 x 0.25: 1 -1.85,1; 2 -1.85,0.5; 3 -1.85,0; 4 -1.85,-0.5; 5 -1.85,-1; 11 1.85,-1; 12 1.85,-0.5; 13 1.85,0; 14 1.85,0.5; 15 1.85,1 | smd 0.25 x 0.5: 6 -1,-1.85; 7 -0.5,-1.85; 8 0,-1.85; 9 0.5,-1.85; 10 1,-1.85; 16 1,1.85; 17 0.5,1.85; 18 0,1.85; 19 -0.5,1.85; 20 -1,1.85 | smd 2.5 x 2.5: PAD 0,0

### Placement (x,y rotation side)
C4  66.1,22.51 270 bottom
C5  61.78,22.51 90 bottom
C6  21.27,9.81 270 top
C7  14.79,9.81 270 top
C8  22.16,25.94 180 bottom
C9  26.48,38.89 90 bottom
C10  25.46,31.14 90 bottom
C11  29.52,38.89 90 bottom
C12  33.97,35.46 270 bottom
C13  34.73,25.05 180 bottom
C14  31.81,21.87 270 bottom
C17  31.68,43.34 90 top
C23  22.03,39.15 270 top
C24  40.19,18.06 0 top
C29  67.12,27.33 270 top
C30  66.61,37.11 0 top
C31  64.7,27.33 270 top
C32  68.77,31.78 270 top
D2  4.63,10.95 180 top
IC2  63.81,26.83 180 bottom
J1  8.06,23.91 234 top
LA  17.08,29.49 90 bottom
LED1  16.06,27.72 55 top
LED2  30.92,35.08 0 top
LED3  55.69,17.3 270 bottom
LED4  58.86,17.3 90 bottom
LOGO2  56.83,41.69 0 top
LS1  61.4,20.35 270 top
Q3  68.13,28.48 90 bottom
Q4  9.71,11.97 270 top
R1  55.69,19.59 0 bottom
R2  58.86,19.59 180 bottom
R3  57.72,30.13 0 bottom
R4  58.1,35.34 270 top
R5  58.1,38.51 90 top
R6  28.76,42.83 0 top
R7  31.3,14.89 180 top
R8  27.49,18.32 0 top
R9  41.21,22.51 270 top
R10  62.42,28.1 90 top
R11  60.39,31.27 0 top
R12  62.8,30.13 180 bottom
R13  63.94,22.51 90 bottom
R14  44.38,41.69 180 bottom
R15  44.38,43.84 0 bottom
R16  4.12,14.38 180 top
R17  22.16,23.65 0 bottom
R18  25.71,33.94 180 bottom
R19  22.16,21.37 0 bottom
R20  50.61,22.76 0 top
R21  22.16,28.48 0 bottom
R22  22.16,35.72 0 bottom
R23  22.16,33.3 0 bottom
R24  30.03,36.1 180 bottom
R25  27.37,25.05 0 bottom
R26  30.03,33.94 180 bottom
R27  33.46,32.67 180 bottom
R28  36,28.22 90 bottom
R29  33.72,28.22 270 bottom
R30  29.65,21.87 270 bottom
R31  31.3,25.05 180 bottom
R32  22.16,30.89 0 bottom
R33  13.01,30 323 top
R34  4.12,16.54 180 top
R35  30.92,32.03 180 top
RA  17.08,34.32 90 bottom
S1  25.33,39.02 270 top
SW1  31.3,26.83 0 top
T1  27.49,14.63 180 top
T2  31.3,18.57 0 top
T3  50.99,19.21 270 top
TP1  23.68,7.4 0 top
TP2  10.86,14.63 0 top
U1  44.89,38.38 0 top
U2  57.34,24.79 270 bottom
U4  18.86,16.41 270 top
U5  45.27,21.24 90 top
U11  64.83,32.92 0 top
U$2  18.09,9.81 180 top
U$3  29.4,28.99 180 bottom
U$10  44.76,46.89 0 bottom
VBAT+  70.16,20.48 125 bottom
VBAT-  72.2,23.52 125 bottom

### Tracks (layer width: path | path; a pad name or v marks a point on that pad's centre or on a via)
+3V3  (via drill 0.35)
  Top 0.254: C32.1 68.47,32.63 67.52,31.67 U11.13 64.68,31.67 64.07,32.29 v64.07,33.43
  Top 0.406: R4.1 R5.1 58.19,37.75 v59.88,37.75 62.54,37.75 63.31,36.99 v63.31,36.22 | 23.05,10.82 21.44,10.82 C6.1 21.18,10.75 U$2.2 17.84,12.09 13.65,12.09 12.76,12.98 12.76,14.51 13.65,15.4 18.86,15.4 19.49,16.03 U4.4 | 23.05,10.82 23.3,11.08 | 23.3,11.08 U4.16 | U1.2 36,42.37 | 36,42.37 31.8,42.37 C17.1 31.34,42.83 R6.2 29.65,42.87 v29.65,44.99 | 23.3,10.82 23.56,10.82 | 23.68,10.82 24.19,10.82 | 24.19,10.82 v25.33,10.82 | v35.49,18.06 C24.1 39.34,18.74 39.68,19.08 43.37,19.08 43.62,18.82 U5.1 | LS1.P 62.98,23.85 62.42,24.41 R10.1 60.35,27.25 59.54,28.06 R11.1 59.88,31.61 v59.88,34.07 | v50.86,39.91 49.08,39.91 46.54,42.45 36.08,42.45 36,42.37 | v37.27,25.56 35.62,23.91 v35.62,23.27 | 23.3,11.08 23.56,10.82 | 23.56,10.82 23.68,10.82 | TP1.TP 23.68,10.32 | 23.68,10.32 23.68,10.44 | 23.68,10.82 23.68,10.44 | 23.68,10.44 23.3,10.82 | 23.3,10.82 23.17,10.82 | 23.68,10.44 23.81,10.44 24.19,10.82 | 23.68,10.32 23.17,10.82 | 23.17,10.82 23.05,10.82
  Bottom 0.254: U$3.17 29.9,26.58 30.16,26.32 31.94,26.32 32.19,26.06 32.19,25.05 | U$3.15 33.1,27.99 R29.2
  Bottom 0.406: C13.1 33.88,27.21 R29.2 | R31.2 32.19,25.05 C13.1 | v25.33,10.82 26.1,10.82 33.33,18.06 34.99,18.06 | 35.43,18.64 35.43,23.08 v35.62,23.27 34.86,23.27 33.88,24.25 C13.1 | 35.62,18.06 v35.49,18.06 34.99,18.06 | 35.62,18.06 36,18.06 35.43,18.64 | 35.43,18.64 35.43,18.25 35.62,18.06 | v50.86,39.91 58.99,39.91 59.88,39.02 v59.88,37.75 v59.88,34.07 | v63.31,36.22 63.31,34.19 v64.07,33.43 | v29.65,44.99 30.29,45.62 36.38,45.62 37.27,44.73 v37.27,25.56 | 34.99,18.06 34.99,18.19 35.43,18.64
BUTTON_DS
  Top 0.406: SW1.1 SW1.2 34.15,27.13 U1.14
BUZZER_EN  (1 unrouted)
DTR  (via drill 0.35)
  Top 0.406: U4.13 19.49,12.48 19.87,12.09 v21.14,12.09 | v25.33,12.09 29.91,12.09 32.15,14.34 R7.1 | 32.25,14.99 R7.1 | R7.1 32.15,17.37 T2.E
  Bottom 0.406: v21.14,12.09 v25.33,12.09
ECG_SIGNAL  (via drill 0.35)
  Top 0.406: U1.5 34.4,38.56 33.84,38 33.84,35.59 32.83,34.57 v32.57,34.57
  Bottom 0.254: U$3.10 30.4,31.26 30.79,31.65 34.1,31.65 34.31,31.87 R27.2
  Bottom 0.406: v32.57,34.57 33.93,34.57 C12.2 34.31,34.27 R27.2
GND  (via drill 0.35)  (1 unrouted)
  Top 0.254: v61.4,34.07 61.91,34.07 62.02,34.17 U11.1 U11.18 73.32,34.17 v73.72,34.57 | U11.11 65.59,30.94 65.59,30.38 66.1,29.87 74.48,29.87 v74.74,30.13 | 14.28,23.69 14.92,24.16 | 14.92,24.16 14.28,24.03 | 14.92,24.16 14.28,24.41 | 14.21,23.7 14.21,24.69 13.98,24.91 J1.G3
  Top 0.406: J1.A1/B12 13.92,23.57 14.17,23.57 14.28,23.69 14.28,24.03 14.28,24.41 14.28,24.72 14.02,24.98 | J1.G3 J1.G1 | J1.G4 J1.B1/A12
  Bottom 0.203: 29.52,28.99 30.4,28.11 U$3.16 32.03,27.14 v32.19,26.98
  Bottom 0.254: 29.52,28.99 U$3.PAD | C13.2 35.24,24.71 | Q3.7 68.46,30.06 68.77,29.75 74.36,29.75 v74.74,30.13 | J1.G3 v15.55,25.81
  Bottom 0.406: Q3.3 Q3.2 68.46,23.83 68.77,23.52 VBAT-.1 | Q3.6 Q3.7 | U2.3 57.97,28.6 58.57,29.2 R3.1 | R28.1 36,25.47 C13.2 36,25.05 37.14,23.91 v37.27,23.91
  other vias: 34.86,15.27 24.95,18.32 33.46,23.27 34.6,49.05 34.6,48.04 34.6,47.02 33.84,21.62 36.89,21.62 65.72,25.94 55.31,48.42 55.31,47.4 55.31,46.38 14.03,32.41 14.79,33.18 20.38,37.62 25.08,43.21 25.97,43.84 26.86,44.48 31.56,39.65 32.57,39.65 66.1,42.83 67.12,42.07 67.88,41.18 68.64,40.42 74.1,33.56 74.36,32.54 74.61,31.27 17.97,2.06 16.19,1.81 14.79,1.81 13.4,1.93 12,2.19 10.73,2.57 9.59,3.08 2.98,8.92 3.87,7.52 56.07,32.8 57.08,32.8 58.1,32.8 61.53,36.86 61.53,35.84 7.3,17.17 7.3,14.51
  pour Bottom (isolate 0.406): -0.96,0.03 76.77,0.03 76.77,53.37 -0.96,53.37
  pour Top (isolate 0.406): 15.17,-0.22 77.02,-0.22 77.02,47.78 77.02,53.62 54.29,53.62 54.29,44.61 35.37,44.61 35.37,52.99 -0.19,52.99 -0.19,2.19 -0.19,-0.22 15.05,-0.22
I2C_SCL
  Top 0.254: U11.23 64.07,34.9 64.07,38 62.93,39.15
  Top 0.406: U1.36 55.38,41.1 57.12,39.36 R5.2 62.71,39.36 62.93,39.15
I2C_SDA
  Top 0.254: R4.2 58.51,34.89 U11.24
  Top 0.406: R4.2 56.03,34.49 55.43,35.08 55.43,36.86 55,37.29 U1.33
IO0  (via drill 0.35)
  Top 0.406: T2.C 31.6,19.97 v39.56,19.97 | U1.25 53.44,27.08 53.27,26.91 v53.27,24.03
  Bottom 0.406: v39.56,19.97 51.88,19.97 52.77,20.86 52.77,23.78 53.02,24.03 v53.27,24.03
LA
  Bottom 0.406: R21.2 21.31,29.49 | 21.31,29.49 R32.2 | 21.31,29.49 LA.1
N$1
  Top 0.406: R7.2 28.76,14.89 28.44,15.21 T1.B
N$2
  Top 0.406: T2.B 28.72,17.47 28.34,17.85 R8.2
N$3
  Top 0.406: R9.2 41.3,21.75 42.86,21.75 43.62,22.51 U5.4
N$4
  Bottom 0.406: R2.1 57.97,19.63 U2.6
N$5
  Top 0.406: R20.2 51.54,22.68 51.54,21.03 50.73,20.22 49.95,20.22 T3.B
N$6
  Bottom 0.406: R1.2 54.84,17.4 LED3.C
N$7
  Bottom 0.406: R2.2 59.71,17.4 LED4.C
N$8
  Top 0.254: U11.10 65.08,30.13 65.97,29.24 66.77,29.24 67.12,28.9 C29.1
N$9
  Bottom 0.406: R1.1 56.7,19.75 U2.7
N$10
  Bottom 0.254: C8.2 23.39,26.32 27.75,26.32 28.4,26.97 U$3.20
  Bottom 0.406: C8.2 R17.1
N$11
  Bottom 0.254: C8.1 21.31,26.74 21.78,27.21 24.83,27.21 25.6,27.99 U$3.1
N$12
  Bottom 0.254: R25.1 28.22,25.64 28.9,26.33 U$3.19
  Bottom 0.406: R19.1 27.49,21.37 28.22,22.09 R25.1
N$13  (via drill 0.35)
  Top 0.254: v25.33,35.59 25.33,30.51 25.71,30.13 25.71,22.89 25.33,22.51 v24.44,22.51
  Bottom 0.254: R18.1 25.33,34.41 v25.33,35.59 | v24.44,22.51 21.44,22.51 21.31,22.64
  Bottom 0.406: R19.2 21.31,22.64 R17.2
N$14
  Bottom 0.254: U$3.6 27.87,31.36 27.87,31.78 26.56,33.09 R18.2 26.48,34.03 C9.1
N$15
  Top 0.406: R33.2 LED1.C
N$16  (via drill 0.35)
  Top 0.406: v26.6,23.14 27.24,23.78 27.24,36.35 29.02,38.13 v31.3,38.13
  Bottom 0.406: R24.2 31.1,36.31 32.45,36.31 | 32.45,36.31 C12.1 | R25.2 26.6,24.96 v26.6,23.14 | v31.3,38.13 31.81,38.13 32.45,37.49 32.45,36.31
N$17
  Bottom 0.406: U2.2 56.7,29.96 R3.2
N$18
  Bottom 0.254: R21.1 U$3.2
N$19  (via drill 0.35)
  Top 0.254: v24.7,29.14 24.32,29.52 v24.32,35.59
  Bottom 0.254: U$3.3 24.95,28.99 24.79,29.14 v24.7,29.14 | v24.32,35.59 24.19,35.72 R22.1
N$20
  Top 0.406: 8.2,20.67 R34.1 5.36,16.16 9.97,16.16 11.49,17.68 11.49,18.44 J1.B4/A9 9.33,20.35 9.01,20.67 8.2,20.67 | 8.2,20.67 8.44,20.98 10.35,23.65 11.11,24.16 J1.A4/B9
N$21
  Bottom 0.406: IC2.1 61.37,28.13 60.51,28.99 60.51,31.91 61.02,32.41 66.61,32.41 67.16,31.87 Q3.5
N$22
  Top 0.406: LS1.N 55,23.85 53.74,22.59 53.74,19.67 53.53,19.46 52.34,19.46 T3.C
N$23
  Bottom 0.406: IC2.3 66.83,28.13 67.16,27.8 Q3.4
N$24
  Top 0.254: R10.2 62.54,29.07 62.54,30.64 62.86,30.95 U11.7
N$25
  Top 0.254: R11.2 61.64,31.67 U11.6
N$26
  Top 0.254: C31.1 64.08,28.81 U11.8
N$27
  Top 0.254: U11.20 65.58,36.94 C30.1
N$28
  Bottom 0.406: IC2.2 63.81,29.96 R12.2
N$29
  Bottom 0.406: C4.1 R13.2 63.81,23.49 IC2.5
N$30
  Bottom 0.254: U$3.4 26.74,29.49 25.93,30.29 C10.1
N$31
  Bottom 0.254: U$3.5 27.49,30.04 27.49,31.02 26.52,31.99 C10.2 25.42,32.03 23.01,32.03
  Bottom 0.406: R32.1 23.01,32.03 R23.1
N$32
  Top 0.406: R35.1 31.95,32.21 U1.10
N$33
  Top 0.406: R35.2 30.92,32.88 LED2.A
N$34  (via drill 0.35)
  Top 0.254: v28,35.72 28,32.8 v28.51,32.29
  Bottom 0.254: U$3.7 28.89,31.91 v28.51,32.29 | R24.1 28.13,36.1 28,35.97 v28,35.72
  Bottom 0.406: R24.1 29.52,36.44 C11.1
N$36
  Bottom 0.254: U$3.9 29.9,32.15 30.41,32.67 30.79,32.67 | 30.79,32.67 31.18,32.67 | 31.18,32.67 31.56,32.67 | 31.56,32.67 R27.1 | R26.2 31.18,33.65 31.18,33.05 | 31.18,33.05 31.18,32.67 | 31.18,33.05 30.79,32.67 | 31.18,33.05 31.56,32.67
N$38
  Bottom 0.254: U$3.14 33.13,28.49 R29.1
  Bottom 0.406: R29.1 R28.2
N$39
  Bottom 0.254: 31.18,22.98 31.18,23.36 30.88,23.06 | 31.18,22.98 31.18,22.72 | 30.88,23.06 30.54,22.72 30.29,22.72 | 31.18,22.98 31,22.81 | 31,22.81 30.92,22.72 | 30.88,23.06 31.09,23.06 31.18,22.98 | 30.88,23.06 31,22.93 31,22.81 | C14.1 31.43,22.72 31.18,22.98 | U$3.18 29.4,25.18 | 29.4,25.18 29.4,24.92 | R30.1 29.4,22.98 29.4,24.79 29.4,24.92 | 29.4,25.18 29.52,25.05 | R31.1 29.52,25.05 | 29.52,25.05 29.4,24.92
  Bottom 0.406: R31.1 31.18,24.33 31.18,23.36 C14.1 31.18,22.72 30.92,22.72 30.29,22.72 R30.1
RA
  Bottom 0.406: R22.2 21.31,34.32 | 21.31,34.32 R23.2 | 21.31,34.32 RA.1
REFOUT
  Bottom 0.254: U$3.8 29.4,33.72 R26.1 28.64,33.94 27.3,35.27 27.3,36.41 28.13,37.24 28.13,39.4 | 28.13,39.74 28.13,39.4 | 28.13,39.4 28.09,39.4 27.75,39.74 | 28.13,39.4 28.47,39.74 28.64,39.74
  Bottom 0.406: C9.2 27.75,39.74 28.13,39.74 28.64,39.74 C11.2
RGB
  Top 0.406: R9.1 40.45,24.12 U1.16
RST  (via drill 0.35)
  Top 0.406: T1.C 27.32,13.36 25.46,13.36 25.08,13.75 v25.08,14.38 | 27.41,41.09 S1.1 23.13,41.09 C23.1 20.57,40 19.99,39.41 18.98,38.41 18.98,22.64 18.22,21.87 v15.17,21.87 | 27.41,41.09 27.87,41.09 | 27.87,41.09 28.38,41.09 | 28.38,41.09 U1.3 | R6.1 27.87,42.79 27.87,41.56 | 27.87,41.09 27.87,41.56 | 27.87,41.56 27.41,41.09 | 27.87,41.56 27.92,41.56 28.38,41.09
  Bottom 0.406: v25.08,14.38 25.08,16.67 24.7,17.05 13.65,17.05 12.76,17.94 12.76,20.6 14.03,21.87 v15.17,21.87
RTS
  Top 0.406: U4.14 20.76,15.27 21.27,15.78 26.5,15.78 T1.E 26.54,18.22 R8.1
UART0_RX  (via drill 0.35)
  Top 0.406: U1.34 55.25,38.56 v56.07,37.75 | v39.56,21.37 38.92,20.73 28,20.73 27.75,20.48 22.41,20.48 22.03,20.1 U4.2
  Bottom 0.406: v56.07,37.75 55.18,36.86 52.64,36.86 51.88,36.1 51.88,21.87 51.37,21.37 v39.56,21.37
UART0_TX  (via drill 0.35)
  Top 0.406: U1.35 55.25,39.83 v55.94,39.15 | U4.3 20.76,20.22 21.9,21.37 27.11,21.37 28.13,22.38 37.91,22.38 38.54,23.02 v39.56,23.02
  Bottom 0.406: v39.56,23.02 49.84,23.02 50.35,23.52 50.35,37.88 50.99,38.51 55.31,38.51 v55.94,39.15
USB_D+
  Top 0.254: J1.A6 13.01,20.6 17.71,20.6 18.22,20.22 U4.5 18.22,17.94 17.84,17.56 12.89,17.56 12.25,18.19 12.25,19.84 12.13,19.97 J1.B6
USB_D-
  Top 0.254: J1.B7 11.49,22.38 11.11,22.38 10.73,22 10.8,21.63 J1.A7 12.51,20.35 12.89,19.97 12.89,18.7 13.52,18.06 16.7,18.06 16.95,18.32 U4.6
VBAT  (via drill 0.35)
  Top 0.406: v12.51,11.59 12.13,11.97 Q4.3 10.81,14.59 TP2.TP | v52.64,17.94 53.27,18.57 v62.16,18.57
  Bottom 0.254: 37.65,18.44 38.03,18.44 | 38.03,18.44 38.29,18.44 | 38.41,18.32 37.53,18.32 37.46,18.25 38.16,18.25 | 38.16,18.25 38.48,18.25 38.54,18.32 | 38.16,18.25 38.16,18.44 38.29,18.57 | 38.03,18.44 38.03,18.57 37.91,18.7
  Bottom 0.406: U2.5 59.24,21.75 59.33,21.66 C5.1 R13.1 63.94,19.71 | v12.51,11.59 14.54,9.55 26.73,9.55 34.22,17.05 36.26,17.05 37.46,18.25 37.65,18.44 37.91,18.7 38.29,19.08 | v52.64,17.94 52.26,18.32 38.54,18.32 38.41,18.32 38.29,18.44 38.29,18.57 38.29,19.08 | R14.2 45.27,41.65 45.27,40.8 44.51,40.03 39.56,40.03 38.29,38.76 38.29,19.08 | v62.16,18.57 62.8,19.21 63.43,19.21 | VBAT+.1 68.89,19.21 64.45,19.21 | 63.43,19.21 63.94,19.21 | 63.94,19.21 64.45,19.21 | 63.94,19.71 63.94,19.21 | 63.43,19.21 63.94,19.71 | 63.94,19.71 64.45,19.21
VBAT_SENSE  (via drill 0.35)
  Top 0.406: U1.4 39.1,39.83 40.95,41.69 v41.21,41.69
  Bottom 0.406: R15.2 R14.1 v41.21,41.69
VCC
  Top 0.406: D2.C 8.55,10.95 | 8.55,10.95 Q4.2 | 8.55,10.95 8.84,10.66 C7.1 16.61,10.66 17,10.27 U$2.3
VUSB  (via drill 0.35)
  Top 0.406: D2.A 3.27,11.27 3.27,12.73 | 3.27,12.73 3.27,14 R16.2 R34.2 3.27,17.21 v4.25,18.19 | 3.27,12.73 8.42,12.73 Q4.1 | v61.02,20.22 v61.02,25.05 | v37.65,17.05 33.97,17.05 33.72,17.3 v33.72,18.95 | LED1.A 16.76,26.95 v13.9,26.95
  Bottom 0.406: v4.25,18.19 6.28,18.19 12.76,26.95 v13.9,26.95 16.32,26.95 16.7,26.57 16.7,19.97 17.33,19.33 33.33,19.33 v33.72,18.95 | U2.4 60.58,27.27 61.02,26.83 v61.02,25.05 | 58.48,15.9 58.11,16.27 LED4.A LED3.A | U2.8 53.85,22.32 53.65,22.13 53.65,16.67 | 53.65,16.67 53.65,16.29 54.04,15.9 58.48,15.9 | 58.48,15.9 60.39,15.9 61.02,16.54 v61.02,20.22 | 53.65,16.67 52.13,16.67 51.31,17.49 38.09,17.49 v37.65,17.05

### Text on the board
tPlace: VBAT | +3V3 | SI_SCA ver.3.0 / Oct - 2022
bPlace: RA | LA | VBAT- | VBAT+